# Altium project PCB_Project.PrjPcb
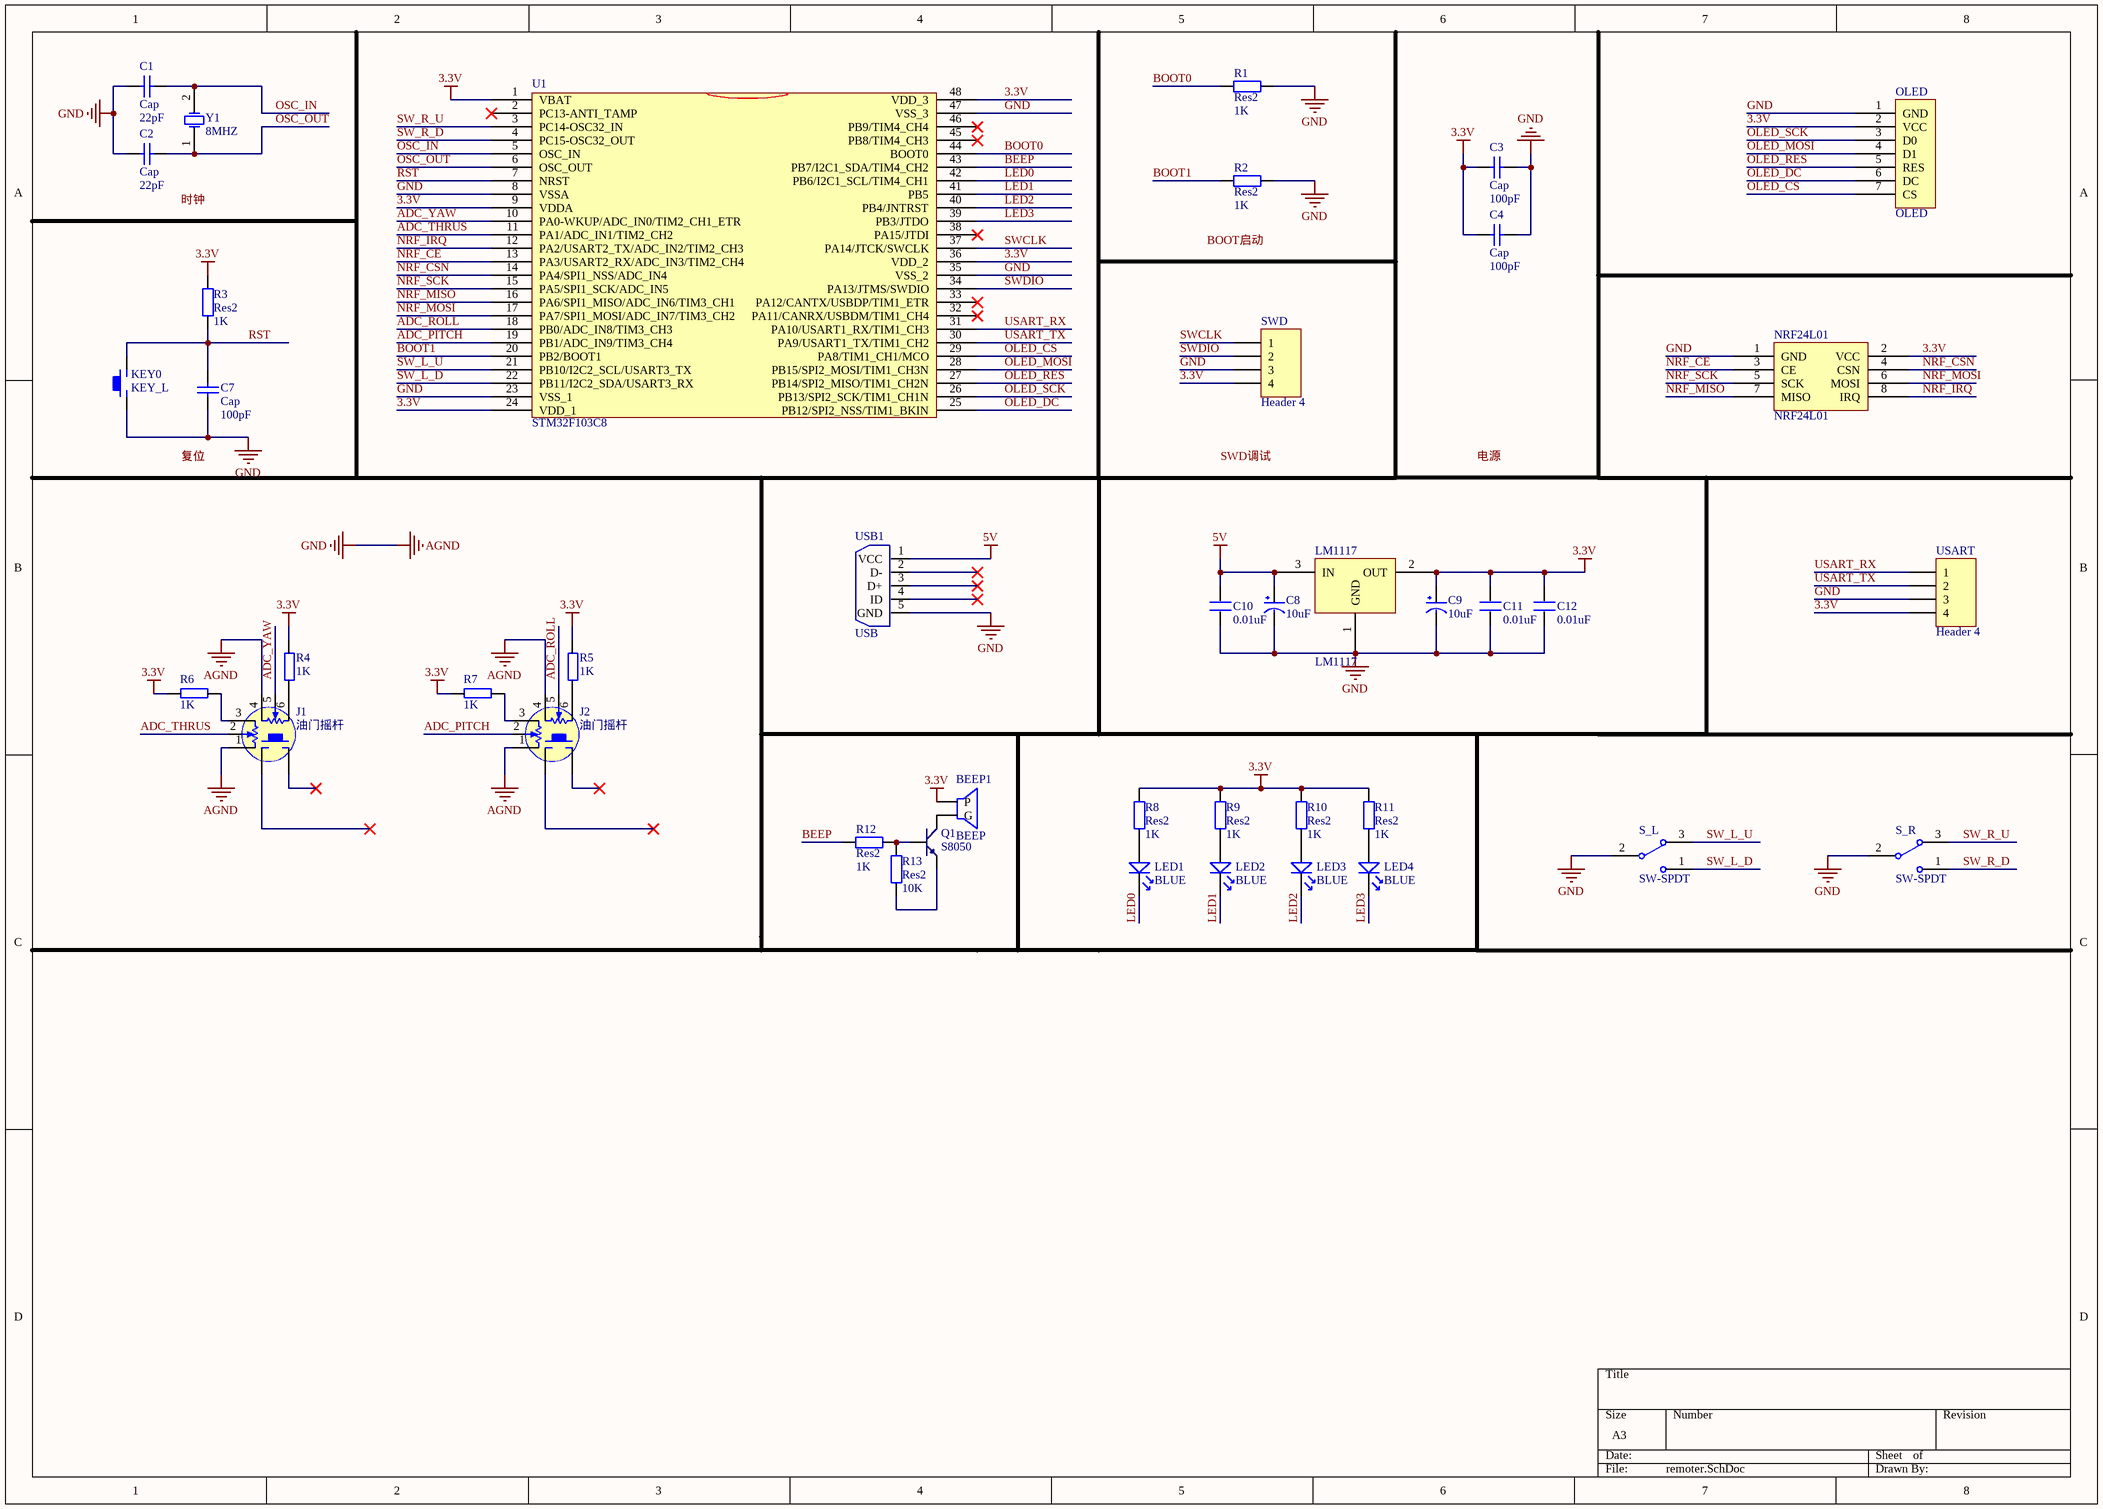
[diagram p0: remoter.SchDoc]
1 sheet, 42 parts. Net scope: global (net labels, ports and power ports of the same name join across sheets).
Board file: remoter_pcb.PcbDoc

## Sheet remoter.SchDoc
size A3

### Parts
BEEP1  BEEP  [BELL-5]
C1  Cap  value 22pF  [0805]
C2  Cap  value 22pF  [0805]
C3  Cap  value 100pF  [0805]
C4  Cap  value 100pF  [0805]
C7  Cap  value 100pF  [0805]
C8  10uF  [C1206]
C9  10uF  [C1206]
C10  0.01uF  [0805]
C11  0.01uF  [0805]
C12  0.01uF  [0805]
J1  油门摇杆  [摇杆2]
J2  油门摇杆  [摇杆2]
KEY0  KEY_L  [KEY_M]
LED1  BLUE  [0805]
LED2  BLUE  [0805]
LED3  BLUE  [0805]
LED4  BLUE  [0805]
LM1117  LM1117
NRF24L01  NRF24L01  [HDR2X4]
OLED  OLED  [HDR1X7]
Q1  S8050  [SOT-23R]
R1  Res2  value 1K  [0805]
R2  Res2  value 1K  [0805]
R3  Res2  value 1K  [0805]
R4  1K  [0805]
R5  1K  [0805]
R6  1K  [0805]
R7  1K  [0805]
R8  Res2  value 1K  [0805]
R9  Res2  value 1K  [0805]
R10  Res2  value 1K  [0805]
R11  Res2  value 1K  [0805]
R12  Res2  value 1K  [0805]
R13  Res2  value 10K  [0805]
S_L  SW-SPDT  [扭子开关]
S_R  SW-SPDT  [扭子开关]
SWD  Header 4  [HDR1X4]
U1  STM32F103C8  [mTQFP48]
USART  Header 4  [HDR1X4]
USB1  USB  [MICROUSB-SOP]
Y1  8MHZ  [XTAL3225   无源]

### Nets
3.3V: BEEP1.1(P) C3.1 C4.1 C9.1(VCC) C11.2 C12.2 LM1117.2(OUT) NRF24L01.2(VCC) OLED.2(VCC) R3.2 R4.2 R5.2 R6.2 R7.2 R8.2 R9.2 R10.2 R11.2 SWD.4 U1.1(VBAT) U1.9(VDDA) U1.24(VDD_1) U1.36(VDD_2) U1.48(VDD_3) USART.4
5V: C8.1(VCC) C10.2 LM1117.3(IN) USB1.1(VCC)
GND: C1.1 C2.1 C3.2 C4.2 C7.1 C8.2(GND) C9.2(GND) C10.1 C11.1 C12.1 J1.1 J1.4 J2.1 J2.4 KEY0.1 LM1117.1(GND) NRF24L01.1(GND) OLED.1(GND) R1.2 R2.1 S_L.2 S_R.2 SWD.3 U1.8(VSSA) U1.23(VSS_1) U1.35(VSS_2) U1.47(VSS_3) USART.3 USB1.5(GND)  [also labelled AGND]
ADC_PITCH: J2.2 U1.19(PB1/ADC_IN9/TIM3_CH4)
ADC_ROLL: J2.5 U1.18(PB0/ADC_IN8/TIM3_CH3)
ADC_THRUS: J1.2 U1.11(PA1/ADC_IN1/TIM2_CH2)
ADC_YAW: J1.5 U1.10(PA0-WKUP/ADC_IN0/TIM2_CH1_ETR)
BEEP: R12.2 U1.43(PB7/I2C1_SDA/TIM4_CH2)
BOOT0: R1.1 U1.44(BOOT0)
BOOT1: R2.2 U1.20(PB2/BOOT1)
LED0: LED1.2 U1.42(PB6/I2C1_SCL/TIM4_CH1)
LED1: LED2.2 U1.41(PB5)
LED2: LED3.2 U1.40(PB4/JNTRST)
LED3: LED4.2 U1.39(PB3/JTDO)
NRF_CE: NRF24L01.3(CE) U1.13(PA3/USART2_RX/ADC_IN3/TIM2_CH4)
NRF_CSN: NRF24L01.4(CSN) U1.14(PA4/SPI1_NSS/ADC_IN4)
NRF_IRQ: NRF24L01.8(IRQ) U1.12(PA2/USART2_TX/ADC_IN2/TIM2_CH3)
NRF_MISO: NRF24L01.7(MISO) U1.16(PA6/SPI1_MISO/ADC_IN6/TIM3_CH1)
NRF_MOSI: NRF24L01.6(MOSI) U1.17(PA7/SPI1_MOSI/ADC_IN7/TIM3_CH2)
NRF_SCK: NRF24L01.5(SCK) U1.15(PA5/SPI1_SCK/ADC_IN5)
OLED_CS: OLED.7(CS) U1.29(PA8/TIM1_CH1/MCO)
OLED_DC: OLED.6(DC) U1.25(PB12/SPI2_NSS/TIM1_BKIN)
OLED_MOSI: OLED.4(D1) U1.28(PB15/SPI2_MOSI/TIM1_CH3N)
OLED_RES: OLED.5(RES) U1.27(PB14/SPI2_MISO/TIM1_CH2N)
OLED_SCK: OLED.3(D0) U1.26(PB13/SPI2_SCK/TIM1_CH1N)
OSC_IN: C1.2 U1.5(OSC_IN) Y1.2(OSC2)
OSC_OUT: C2.2 U1.6(OSC_OUT) Y1.1(OSC1)
RST: C7.2 KEY0.2 R3.1 U1.7(NRST)
SW_L_D: S_L.1 U1.22(PB11/I2C2_SDA/USART3_RX)
SW_L_U: S_L.3 U1.21(PB10/I2C2_SCL/USART3_TX)
SW_R_D: S_R.1 U1.4(PC15-OSC32_OUT)
SW_R_U: S_R.3 U1.3(PC14-OSC32_IN)
SWCLK: SWD.1 U1.37(PA14/JTCK/SWCLK)
SWDIO: SWD.2 U1.34(PA13/JTMS/SWDIO)
USART_RX: U1.31(PA10/USART1_RX/TIM1_CH3) USART.1
USART_TX: U1.30(PA9/USART1_TX/TIM1_CH2) USART.2
NetBEEP1_2: BEEP1.2(G) Q1.3(C)
NetJ1_3: J1.3 R6.1
NetJ1_6: J1.6 R4.1
NetJ2_3: J2.3 R7.1
NetJ2_6: J2.6 R5.1
NetLED1_1: LED1.1 R8.1
NetLED2_1: LED2.1 R9.1
NetLED3_1: LED3.1 R10.1
NetLED4_1: LED4.1 R11.1
NetQ1_1: Q1.1(E) R13.1
NetQ1_2: Q1.2(B) R12.1 R13.2

Not connected (* = marked no-connect by the designer): J1 J1* J2*; J2 J1* J2*; U1 2(PC13-ANTI_TAMP)* 32(PA11/CANRX/USBDM/TIM1_CH4)* 33(PA12/CANTX/USBDP/TIM1_ETR)* 38(PA15/JTDI)* 45(PB8/TIM4_CH3)* 46(PB9/TIM4_CH4)*; USB1 2(D-)* 3(D+)* 4(ID)*

### Notes on the sheet
- 时钟
- BOOT启动
- 复位
- SWD调试
- 电源

### Library data of the parts
C1-C4 C7 = Cap: Capacitor; Published: 8-Jun-2000; LatestRevisionDate: 17-Jul-2002; LatestRevisionNote: Re-released for DXP Platform.; PackageReference: RAD-0.3; Publisher: Altium Limited; PackageDescription: Radial Cap, Thru-Hole; 2 Leads; 0.3 in Pin Spacing
C8 C9 = CAP
C10-C12 = C
J1 J2 = 摇杆
KEY0 = KEY
LED1-LED4 = LED
LM1117 = LM1117: 线性稳压3.3V
Q1 = NPN: 8050/BCW846/BCW847
R1-R3 R8-R13 = Res2: Resistor; Published: 8-Jun-2000; LatestRevisionDate: 17-Jul-2002; LatestRevisionNote: Re-released for DXP Platform.; PackageReference: AXIAL-0.4; Publisher: Altium Limited; PackageDescription: Axial Device, Thru-Hole; 2 Leads; 0.4 in Pin Spacing
R4-R7 = R
S_L S_R = SW-SPDT: SPDT Subminiature Toggle Switch, Right Angle Mounting, Vertical Actuation; Published: 24-Mar-1999; LatestRevisionDate: 17-Dec-2003; LatestRevisionNote: Schematic revised, PCB Footprint replaced.; DatasheetVersion: 05-Dec-2000; PackageReference: TL36WW15050; Publisher: Altium Limited; PackageDescription: Switch; 4 Leads; ComponentLink1Description: Manufacturer Link; ComponentLink1URL: http://www.apem.com
SWD USART = Header 4: Header, 4-Pin; LatestRevisionDate: 17-Jul-2002; LatestRevisionNote: Re-released for DXP Platform.; Publisher: Altium Limited
U1 = STM32F103C6
USB1 = USB5
Y1 = XTAL: Crystal Oscillator; Published: 8-Jun-2000; LatestRevisionDate: 17-Jul-2002; LatestRevisionNote: Re-released for DXP Platform.; PackageReference: R38; Publisher: Altium Limited; PackageDescription: Crystal, Thru-Hole; 2 Leads; Body 3.1 x 8.2 mm (Dia.xH)